# Altium schematic sheet Main.SchDoc
size 228 x 101 mm
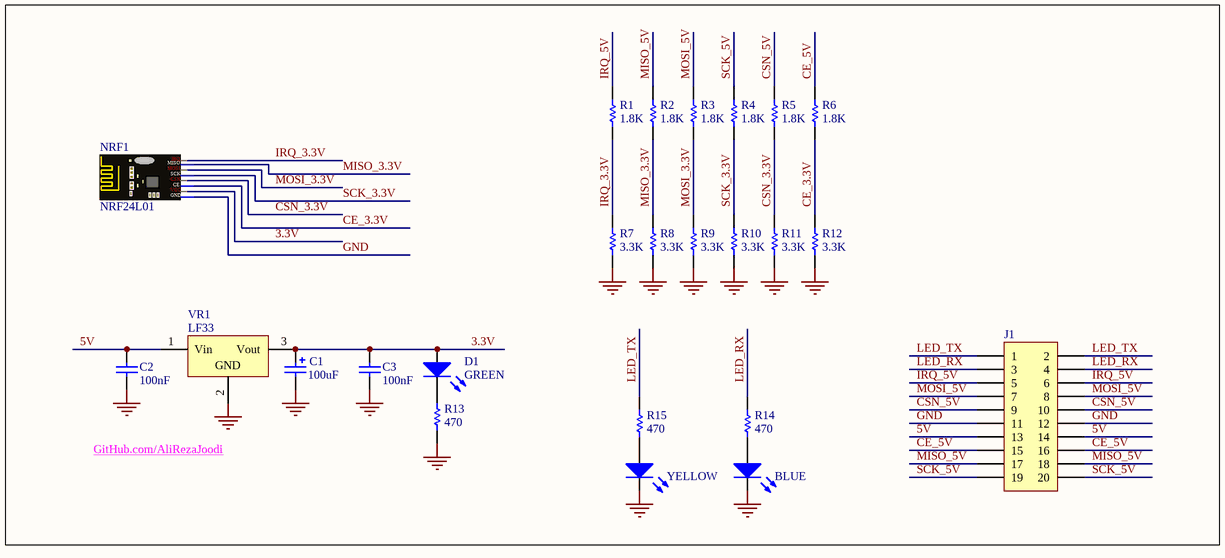
[diagram p0: Main.SchDoc]

## Parts
C1  100uF  [CAPPR2.5-6.3x5]
C2  100nF  [CAPNTO2.54-3.05x1.78A]
C3  100nF  [CAPNTO2.54-3.05x1.78A]
D1  GREEN  [LED-5mm_Red]
D2  BLUE  [LED-5mm_Red]
D3  YELLOW  [LED-5mm_Red]
J1  Header 10X2  [FKV20SN]  (value not drawn)
NRF1  NRF24L01  [NRF24L01+PA+LNA]
R1  1.8K  [AXIAL-0.4]
R2  1.8K  [AXIAL-0.4]
R3  1.8K  [AXIAL-0.4]
R4  1.8K  [AXIAL-0.4]
R5  1.8K  [AXIAL-0.4]
R6  1.8K  [AXIAL-0.4]
R7  3.3K  [AXIAL-0.4]
R8  3.3K  [AXIAL-0.4]
R9  3.3K  [AXIAL-0.4]
R10  3.3K  [AXIAL-0.4]
R11  3.3K  [AXIAL-0.4]
R12  3.3K  [AXIAL-0.4]
R13  470  [AXIAL-0.4]
R14  470  [AXIAL-0.4]
R15  470  [AXIAL-0.4]
VR1  LF33  [TO257H_2]

## Nets
GND: C1.2 C2.1 C3.1 D2.2(K) D3.2(K) J1.11 J1.12 NRF1.GND R7.2 R8.2 R9.2 R10.2 R11.2 R12.2 R13.2 VR1.2(GND)
3.3V: C1.1 C3.2 D1.1(A) NRF1.VCC VR1.3(Vout)
5V: C2.2 J1.13 J1.14 VR1.1(Vin)
CE_3.3V: NRF1.CE R6.2 R12.1
CE_5V: J1.15 J1.16 R6.1
CSN_3.3V: NRF1.CSN R5.2 R11.1
CSN_5V: J1.9 J1.10 R5.1
IRQ_3.3V: NRF1.IRQ R1.2 R7.1
IRQ_5V: J1.5 J1.6 R1.1
LED_RX: J1.3 J1.4 R14.1
LED_TX: J1.1 J1.2 R15.1
MISO_3.3V: NRF1.MISO R2.2 R8.1
MISO_5V: J1.17 J1.18 R2.1
MOSI_3.3V: NRF1.MOSI R3.2 R9.1
MOSI_5V: J1.7 J1.8 R3.1
SCK_3.3V: NRF1.SCK R4.2 R10.1
SCK_5V: J1.19 J1.20 R4.1
NetD1_2: D1.2(K) R13.1
NetD2_1: D2.1(A) R14.2
NetD3_1: D3.1(A) R15.2

## Notes on the sheet
- GitHub.com/AliRezaJoodi

## Library data of the parts
C1 = Cap Pol1: Polarized Capacitor (Radial); Manufacturer: Generic Components; Class I: Passive; Published: 8-Jun-2000; Revision: July-2002: Re-released for DXP Platform.; Publisher: Altium Limited; Class II: Capacitor; Value: 100uF
C2 C3 = Cap: Capacitor; Manufacturer: Generic Components; Class I: Passive; Published: 8-Jun-2000; Revision: July-2002: Re-released for DXP Platform.; Publisher: Altium Limited; Class II: Capacitor; Value: 100nF
D1-D3 = LED: Typical INFRARED GaAs LED; Manufacturer: Generic Components; Class I: Optoelectronic; Published: 8-Jun-2000; Revision: July-2002: Re-released for DXP Platform.; Publisher: Altium Limited; Class II: LED
J1 = Header 10X2: Header, 10-Pin, Dual row; Manufacturer: Generic Components; Class I: Connector; Revision: July-2002: Re-released for DXP Platform.; Publisher: Altium Limited
R1-R15 = Res1: Resistor; Published: 8-Jun-2000; LatestRevisionDate: 17-Jul-2002; LatestRevisionNote: Re-released for DXP Platform.; PackageReference: AXIAL-0.3; Publisher: Altium Limited
VR1 = Volt Reg: Voltage Regulator; Manufacturer: Generic Components; Class I: Power Management; Published: 24-Mar-1999; Revision: July-2002: Re-released for DXP Platform.; Publisher: Altium Limited; Class II: Voltage Regulator